# EAGLE design k64_breakout (EAGLE 8.6.2)
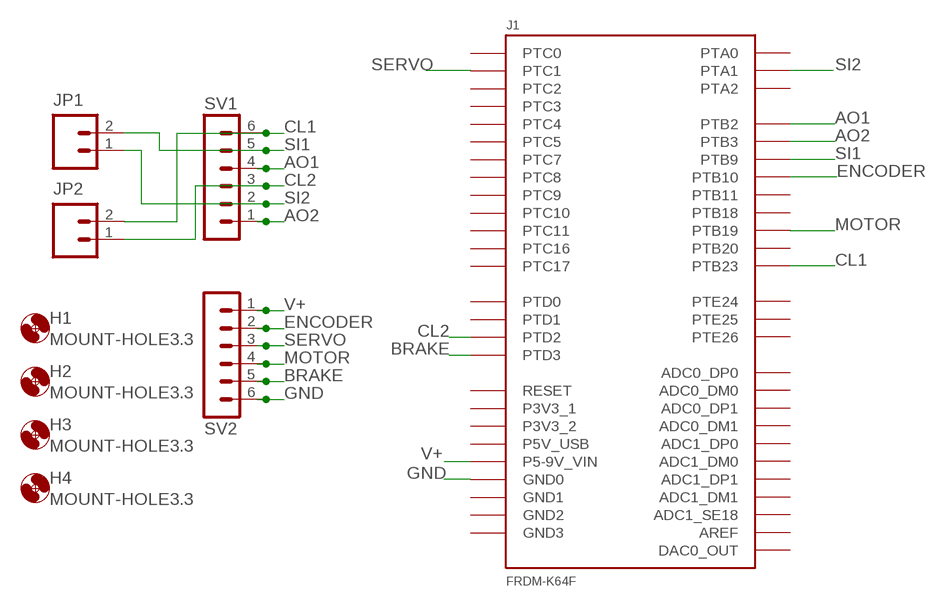
[diagram p0: schematic, sheet 1]

## Parts
H1  MOUNT-HOLE3.3  [3,3]
H2  MOUNT-HOLE3.3  [3,3]
H3  MOUNT-HOLE3.3  [3,3]
H4  MOUNT-HOLE3.3  [3,3]
J1  FRDM-K64F  [FRDM-K64F]
JP1  M02PTH  [1X02]
JP2  M02PTH  [1X02]
SV1  MA06-1  [MA06-1]
SV2  MA06-1  [MA06-1]

## Nets
AO1: J1.J4-2(PTB2) SV1.4
AO2: J1.J4-4(PTB3) SV1.1
BRAKE: J1.J2-10(PTD3) SV2.5
CL1: J1.J1-10(PTB23) JP2.2 SV1.6
CL2: J1.J2-8(PTD2) JP2.1 SV1.3
ENCODER: J1.J4-6(PTB10) SV2.2
GND: J1.J2-3(GND0) SV2.6
MOTOR: J1.J1-3(PTB19) SV2.4
SERVO: J1.J1-5(PTC1) SV2.3
SI1: J1.J1-6(PTB9) JP1.2 SV1.5
SI2: J1.J1-8(PTA1) JP1.1 SV1.2
V+: J1.J3-16(P5-9V_VIN) SV2.1
Unconnected: J1.J1-1(PTB18) J1.J1-2(PTC16) J1.J1-4(PTC17) J1.J1-7(PTC8) J1.J1-9(PTC9) J1.J1-11(PTC0) J1.J1-12(PTA2) J1.J1-13(PTC7) J1.J1-14(PTC2) J1.J1-15(PTC5) J1.J1-16(PTC3) J1.J2-1(PTE26) J1.J2-2(PTA0) J1.J2-4(PTC4) J1.J2-5(ADC0_DP0) J1.J2-6(PTD0) J1.J2-7(ADC0_DM0) J1.J2-11(ADC1_DP0) J1.J2-12(PTD1) J1.J2-13(ADC1_DM0) J1.J2-14(GND1) J1.J2-16(AREF) J1.J2-17(ADC1_SE18) J1.J2-18(PTE25) J1.J2-20(PTE24) J1.J3-4(P3V3_1) J1.J3-6(RESET) J1.J3-8(P3V3_2) J1.J3-10(P5V_USB) J1.J3-12(GND2) J1.J3-14(GND3) J1.J4-1(ADC0_DP1) J1.J4-3(ADC0_DM1) J1.J4-5(ADC1_DP1) J1.J4-7(ADC1_DM1) J1.J4-8(PTB11) J1.J4-9(PTB20) J1.J4-10(PTC11) J1.J4-11(DAC0_OUT) J1.J4-12(PTC10)

## Library data of the parts
H1-H4 = holes:MOUNT-HOLE: MOUNTING HOLE with drill center marker
J1 = ee192:FRDM-K64F: Shield for Freescale Freedom board FRDM-K64F by nathan wong, Team 7 Sp 2016
JP1 JP2 = ee192:M02: 2-pin 0.1-inch header and MTA connector Courtsey of Pioneers in Engineering; PIE-INT-REF-NUM: BULK-STOCK
SV1 SV2 = con-lstb:MA06-1: PIN HEADER; OC_FARNELL: unknown; OC_NEWARK: unknown

## Board
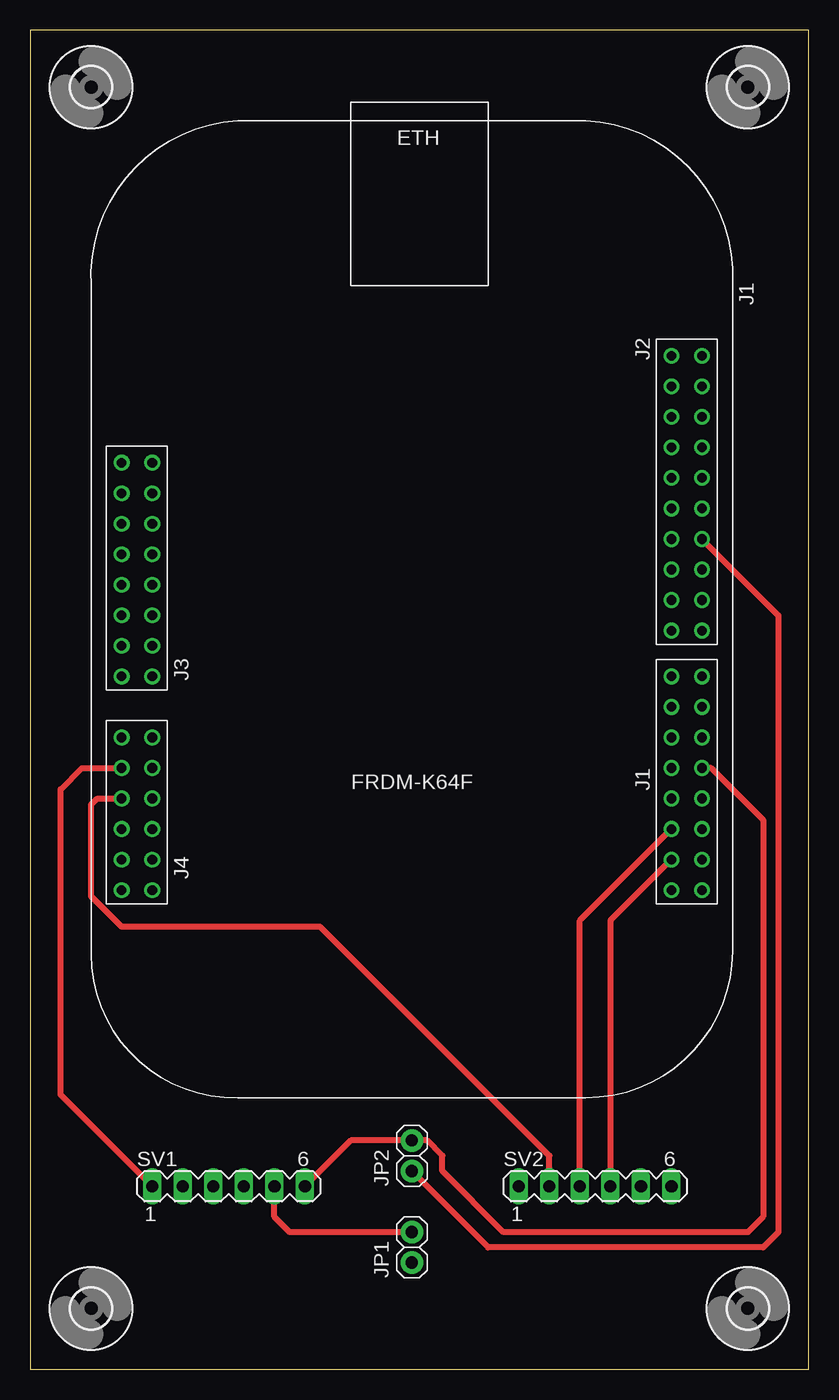
[diagram p1: board, top side]
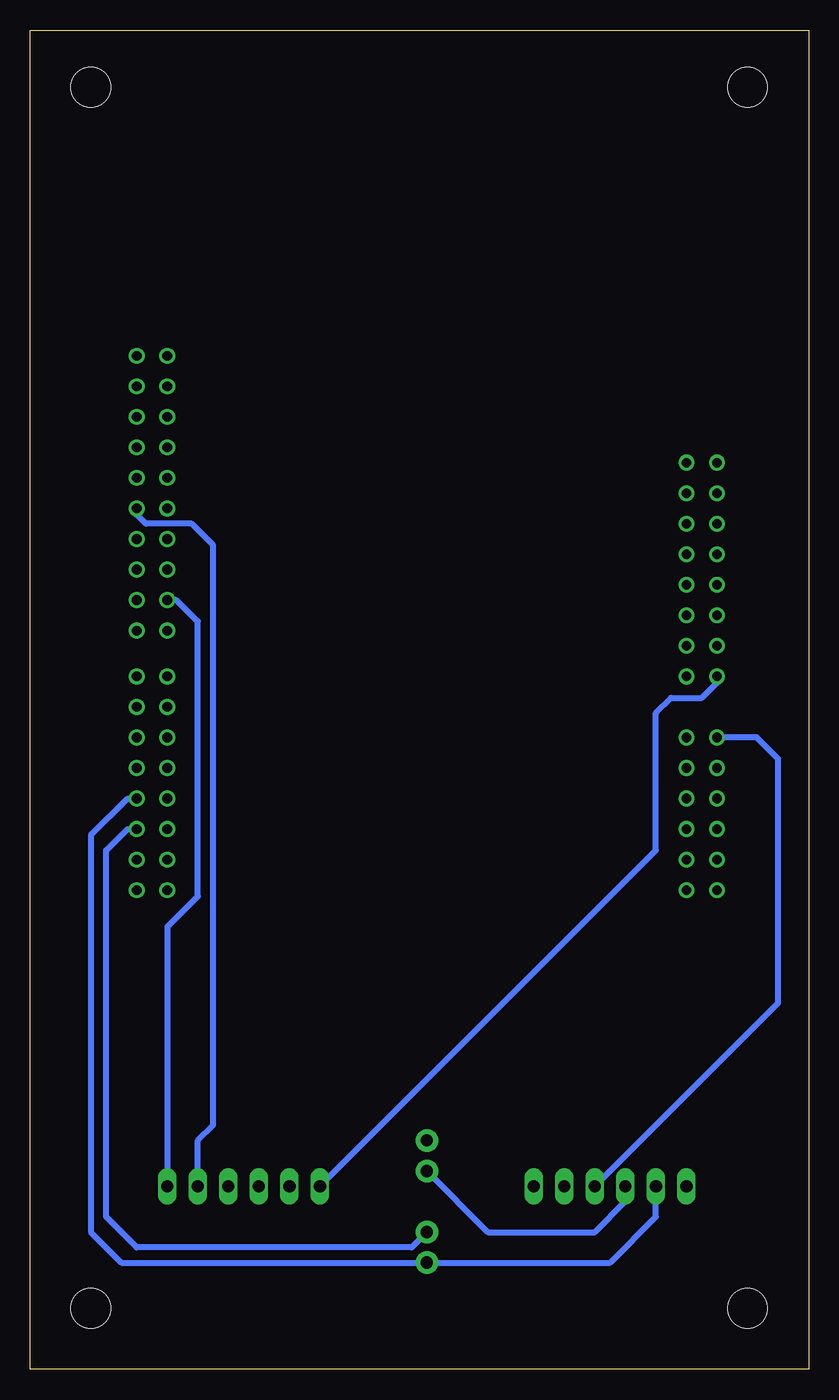
[diagram p2: board, bottom side, seen from below]

Size 64.75 x 111.43 mm. Coordinates in mm from the lower left corner, seen from the top.
Outline: 0,0 64.75,0 64.75,111.43 0,111.43 0,0
Copper layers (1*16): Top 0.035mm / dielectric 1.5mm / Bottom 0.035mm
Design rules "default": minimum track width 6mil, minimum drill 0.35mm, track to track 6mil, track to pad 6mil, pad to pad 6mil, via to via 6mil, smd to smd 6mil, copper to edge 40mil, drill to drill 6mil, minimum pad ring 10mil, minimum via ring 8mil, stop-mask expansion 4mil, vias tented up to drill 0mil, thermal gap 10mil

### Footprints (pad centres in the part's own frame; a part is rotated, then mirrored left to right if it is on the bottom)
3,3 = hole 3.3: 0,0
FRDM-K64F = drill 0.8: J1-1 23.622,21.59; J1-2 23.622,24.13; J1-3 21.082,21.59; J1-4 21.082,24.13; J1-5 18.542,21.59; J1-6 18.542,24.13; J1-7 16.002,21.59; J1-8 16.002,24.13; J1-9 13.462,21.59; J1-10 13.462,24.13; J1-11 10.922,21.59; J1-12 10.922,24.13; J1-13 8.382,21.59; J1-14 8.382,24.13; J1-15 5.842,21.59; J1-16 5.842,24.13; J2-1 2.032,21.59; J2-2 2.032,24.13; J2-3 -0.508,21.59; J2-4 -0.508,24.13; J2-5 -3.048,21.59; J2-6 -3.048,24.13; J2-7 -5.588,21.59; J2-8 -5.588,24.13; J2-9 -8.128,21.59; J2-10 -8.128,24.13; J2-11 -10.668,21.59; J2-12 -10.668,24.13; J2-13 -13.208,21.59; J2-14 -13.208,24.13; J2-15 -15.748,21.59; J2-16 -15.748,24.13; J2-17 -18.288,21.59; J2-18 -18.288,24.13; J2-19 -20.828,21.59; J2-20 -20.828,24.13; J3-1 -11.938,-21.59; J3-2 -11.938,-24.13; J3-3 -9.398,-21.59; J3-4 -9.398,-24.13; J3-5 -6.858,-21.59; J3-6 -6.858,-24.13; J3-7 -4.318,-21.59; J3-8 -4.318,-24.13; J3-9 -1.778,-21.59; J3-10 -1.778,-24.13; J3-11 0.762,-21.59; J3-12 0.762,-24.13; J3-13 3.302,-21.59; J3-14 3.302,-24.13; J3-15 5.842,-21.59; J3-16 5.842,-24.13; J4-1 10.922,-21.59; J4-2 10.922,-24.13; J4-3 13.462,-21.59; J4-4 13.462,-24.13; J4-5 16.002,-21.59; J4-6 16.002,-24.13; J4-7 18.542,-21.59; J4-8 18.542,-24.13; J4-9 21.082,-21.59; J4-10 21.082,-24.13; J4-11 23.622,-21.59; J4-12 23.622,-24.13
1X02 = drill 1.016 pad 1.88: 1 -1.27,0; 2 1.27,0
MA06-1 = drill 1.016 long: 1 -6.35,0; 2 -3.81,0; 3 -1.27,0; 4 1.27,0; 5 3.81,0; 6 6.35,0

### Placement (x,y rotation side)
H1  5.08,5.08 0 top
H2  59.69,5.08 0 top
H3  5.08,106.68 0 top
H4  59.69,106.68 0 top
J1  31.75,63.5 270 top
JP1  31.75,10.16 90 top
JP2  31.75,17.78 90 top
SV1  16.51,15.24 0 top
SV2  46.99,15.24 0 top

### Tracks (layer width: path | path; a pad name or v marks a point on that pad's centre or on a via)
AO1
  Bottom 0.508: SV1.4 2.54,30.48 2.54,50.8 4.32,52.58 J1.J4-2
AO2
  Top 0.508: SV1.1 2.54,22.86 2.54,48.26 4.32,50.04 J1.J4-4
BRAKE
  Bottom 0.508: SV2.5 50.8,19.05 49.53,20.32 49.53,68.58 51.31,70.36 55.12,70.36 55.88,71.12 J1.J2-10
CL1
  Top 0.508: J1.J1-10 56.64,50.04 60.96,45.72 60.96,12.7 59.69,11.43 39.37,11.43 34.29,16.51 34.29,17.78 33.02,19.05 JP2.2 26.67,19.05 SV1.6
CL2
  Top 0.508: J1.J2-8 62.23,62.74 62.23,11.43 60.96,10.16 38.1,10.16 JP2.1
  Bottom 0.508: SV1.3 15.24,13.97 17.78,11.43 26.67,11.43 JP2.1
ENCODER
  Top 0.508: SV2.2 43.18,17.78 24.13,36.83 7.62,36.83 5.08,39.37 5.08,46.99 5.59,47.5 J1.J4-6
GND
  Bottom 0.508: J1.J2-3 52.58,64.01 50.8,62.23 50.8,39.37 53.34,36.83 SV2.6
MOTOR
  Top 0.508: J1.J1-3 48.26,37.34 SV2.4
SERVO
  Top 0.508: SV2.3 45.72,37.34 J1.J1-5
SI1
  Top 0.508: JP1.2 21.59,11.43 20.32,12.7 SV1.5
  Bottom 0.508: JP1.2 33.02,10.16 55.88,10.16 58.42,12.7 58.42,43.18 56.64,44.96 J1.J1-6
SI2
  Bottom 0.508: J1.J1-8 56.64,47.5 59.69,44.45 59.69,31.75 59.69,11.43 57.15,8.89 JP1.1 16.51,8.89 12.7,12.7 SV1.2
V+
  Bottom 0.508: SV2.1 12.7,43.18 12.7,54.61 11.43,55.88 8.89,55.88 7.62,57.15 J1.J3-16